# EAGLE schematic DemoBoard (EAGLE 9.6.2)
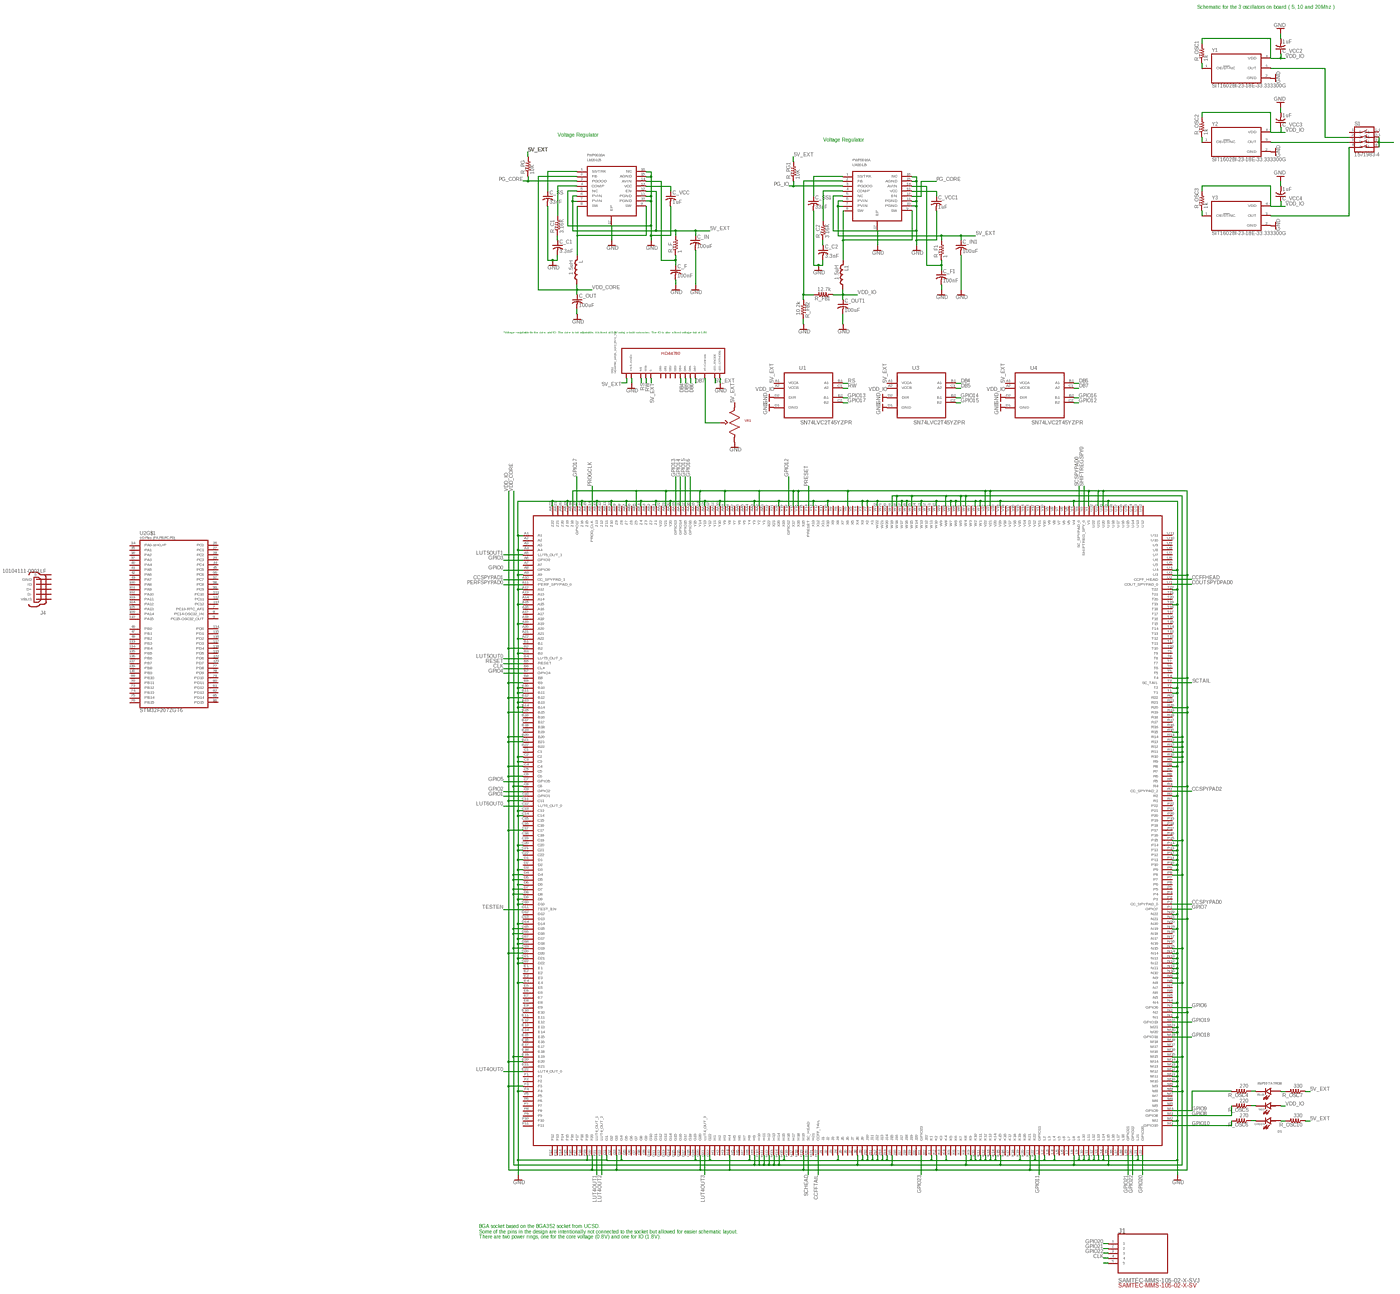
[diagram p0: schematic, sheet 1, overview]
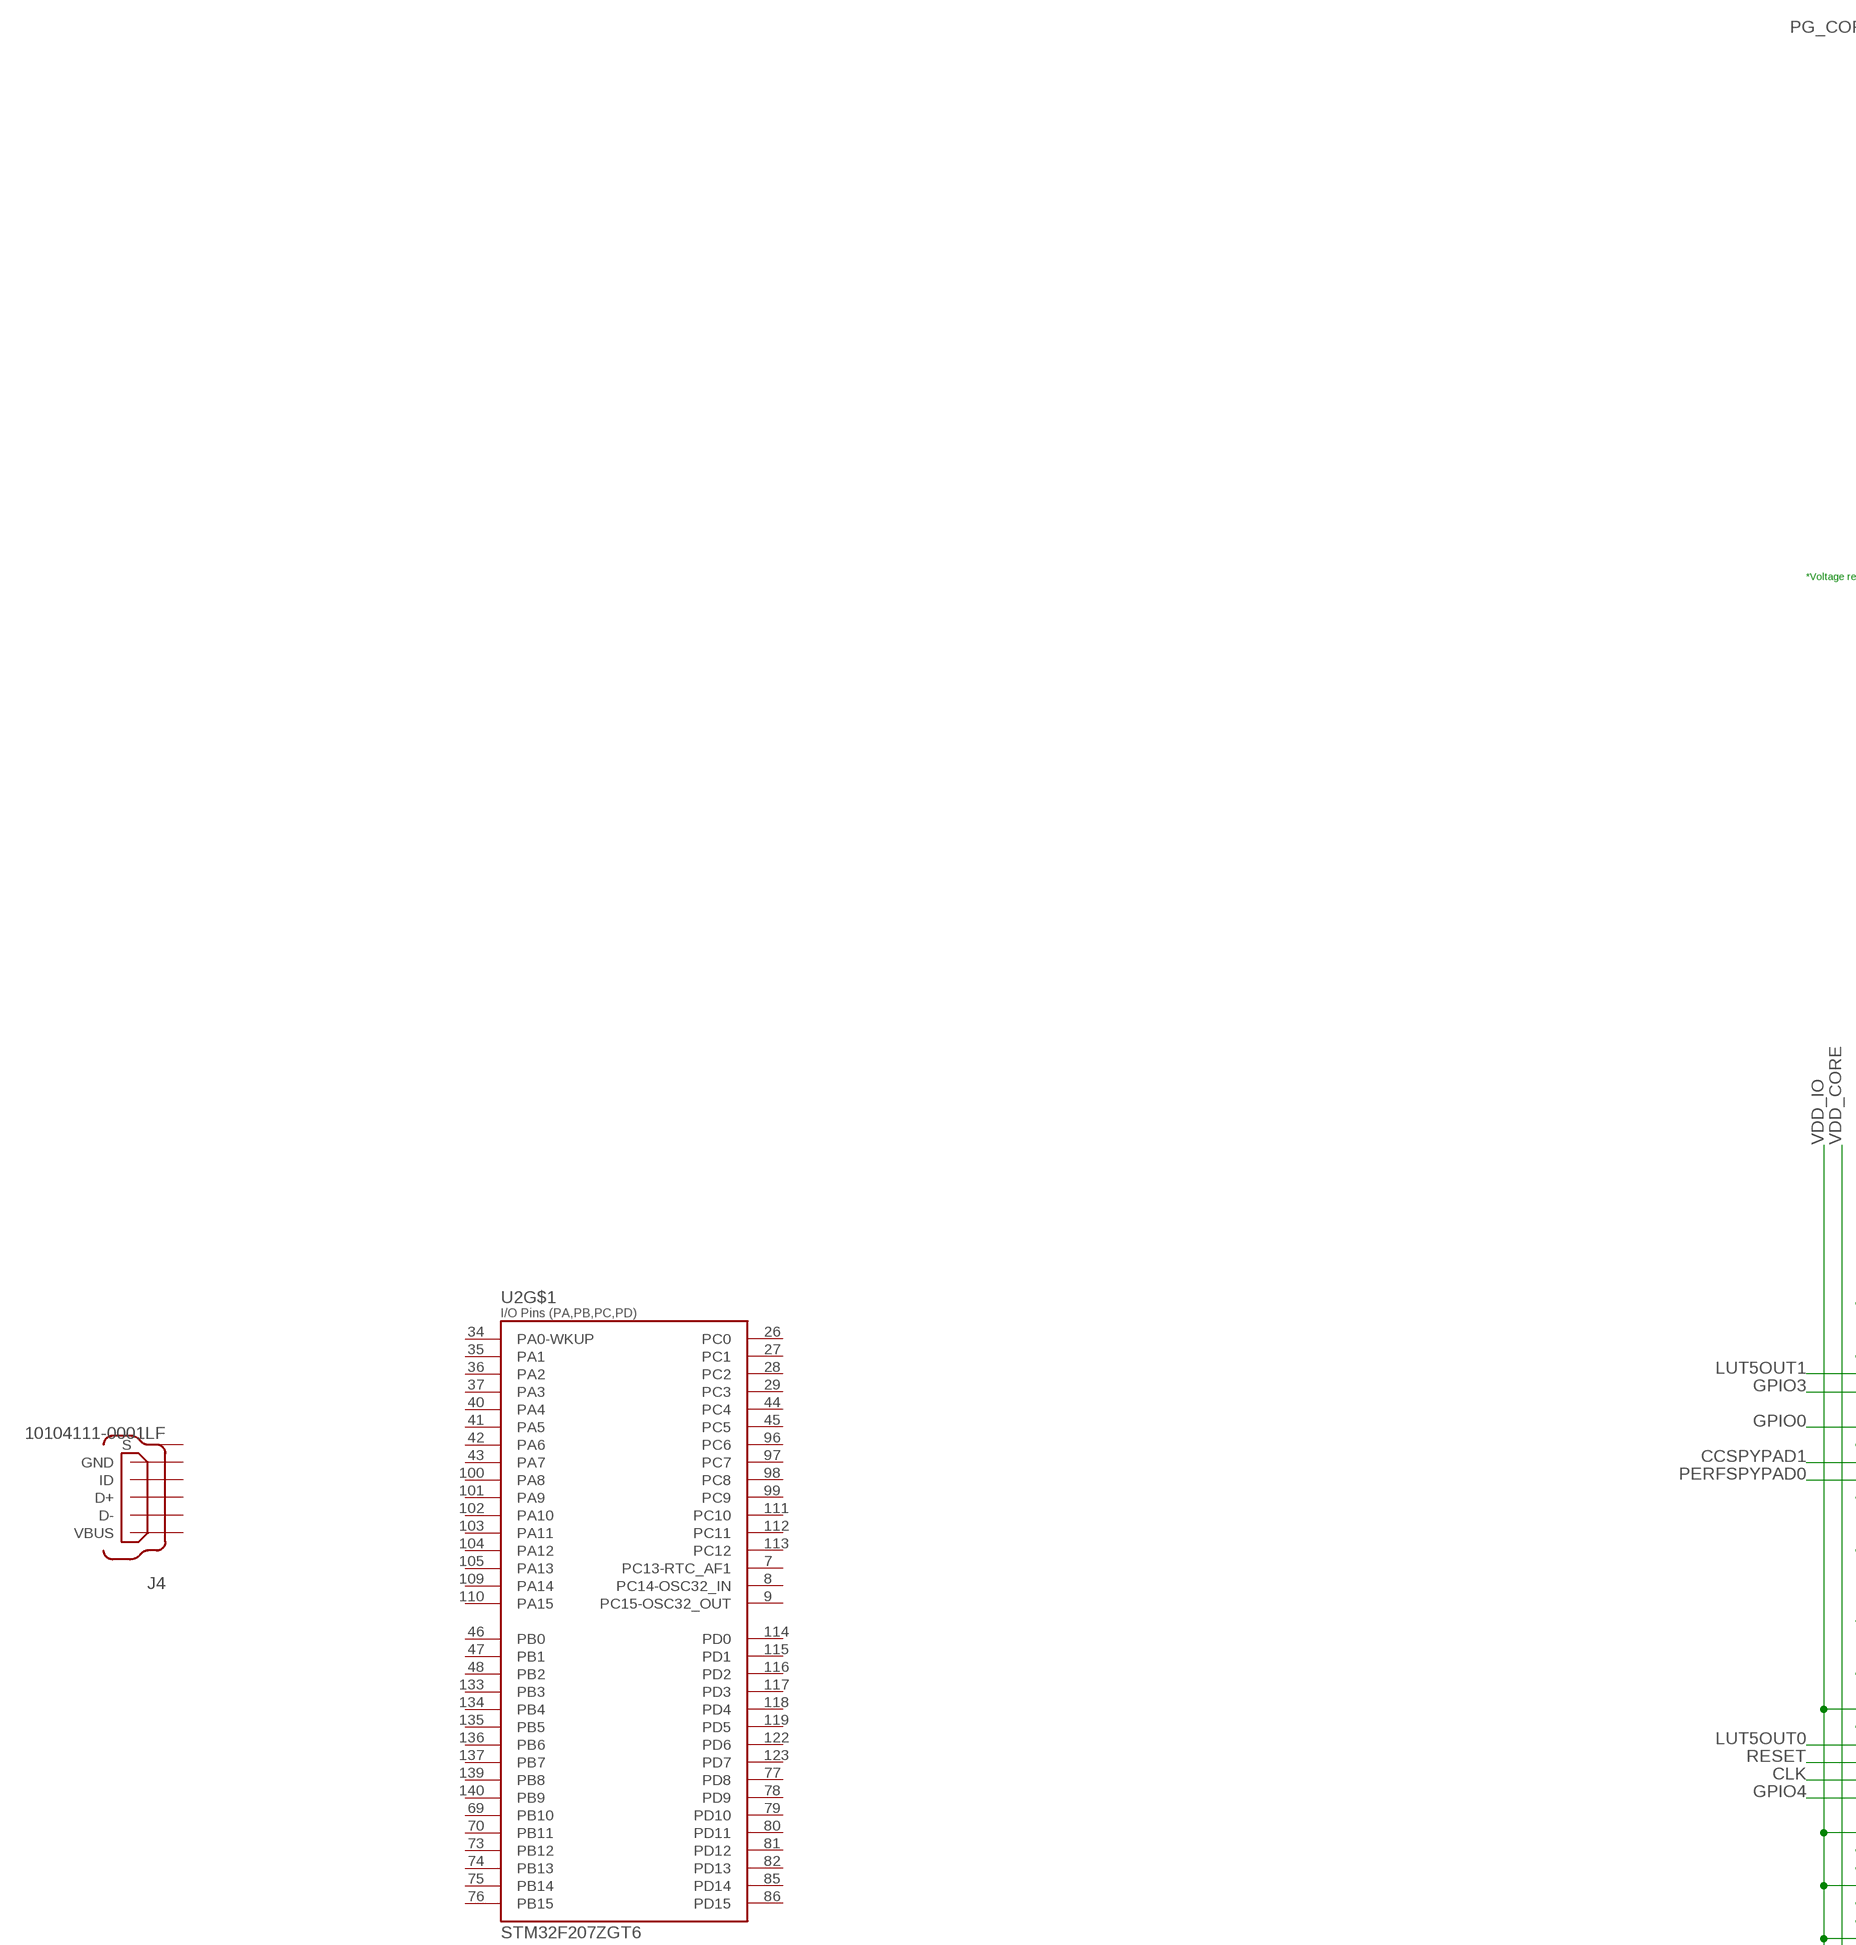
[diagram p1: schematic, sheet 1, part 1 of 4]
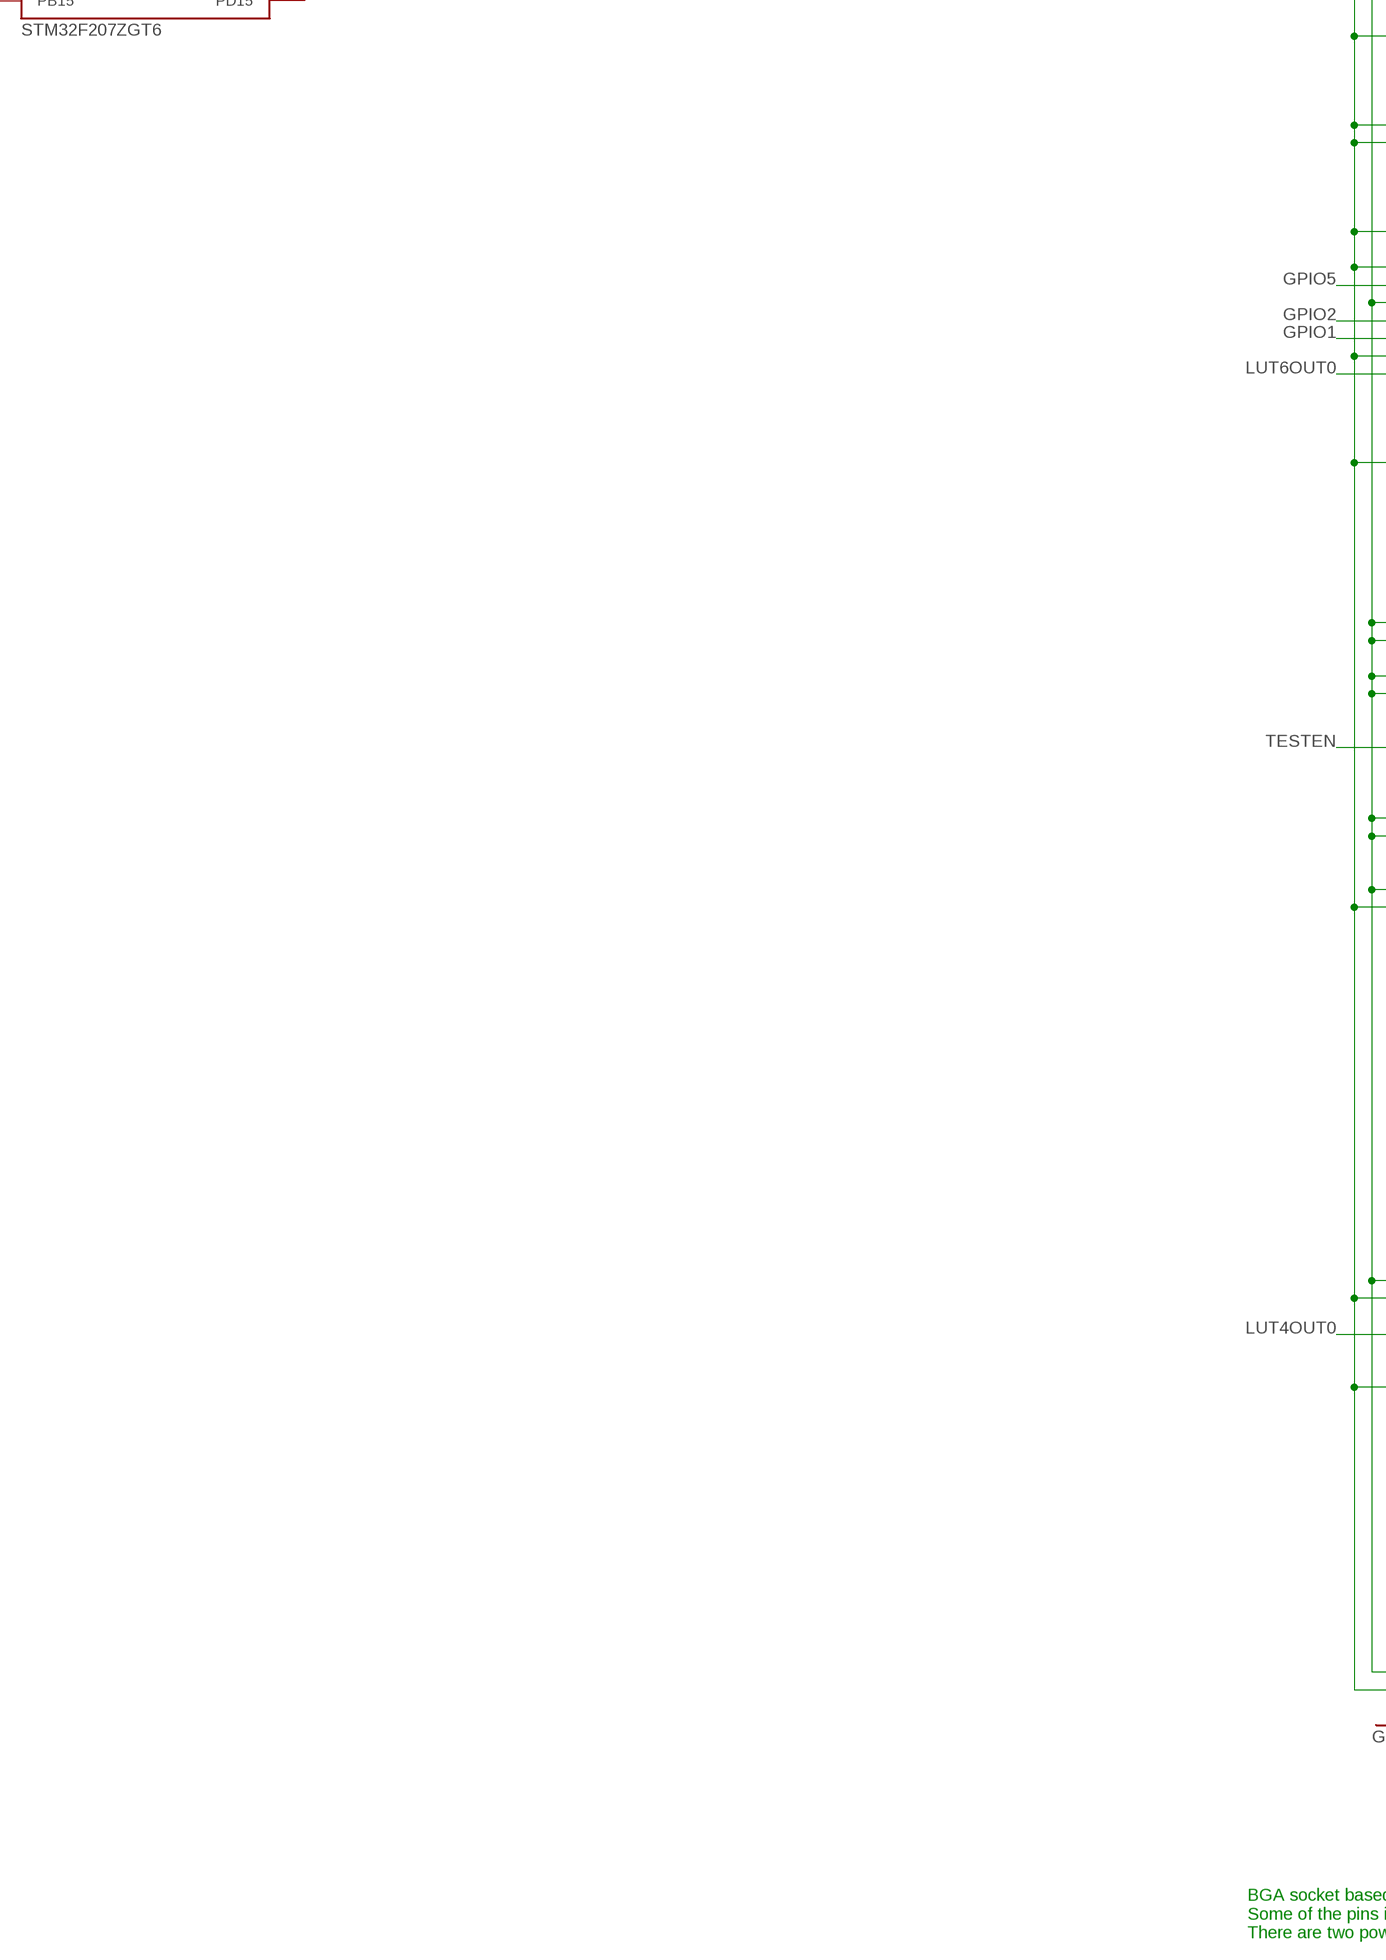
[diagram p2: schematic, sheet 1, part 2 of 4]
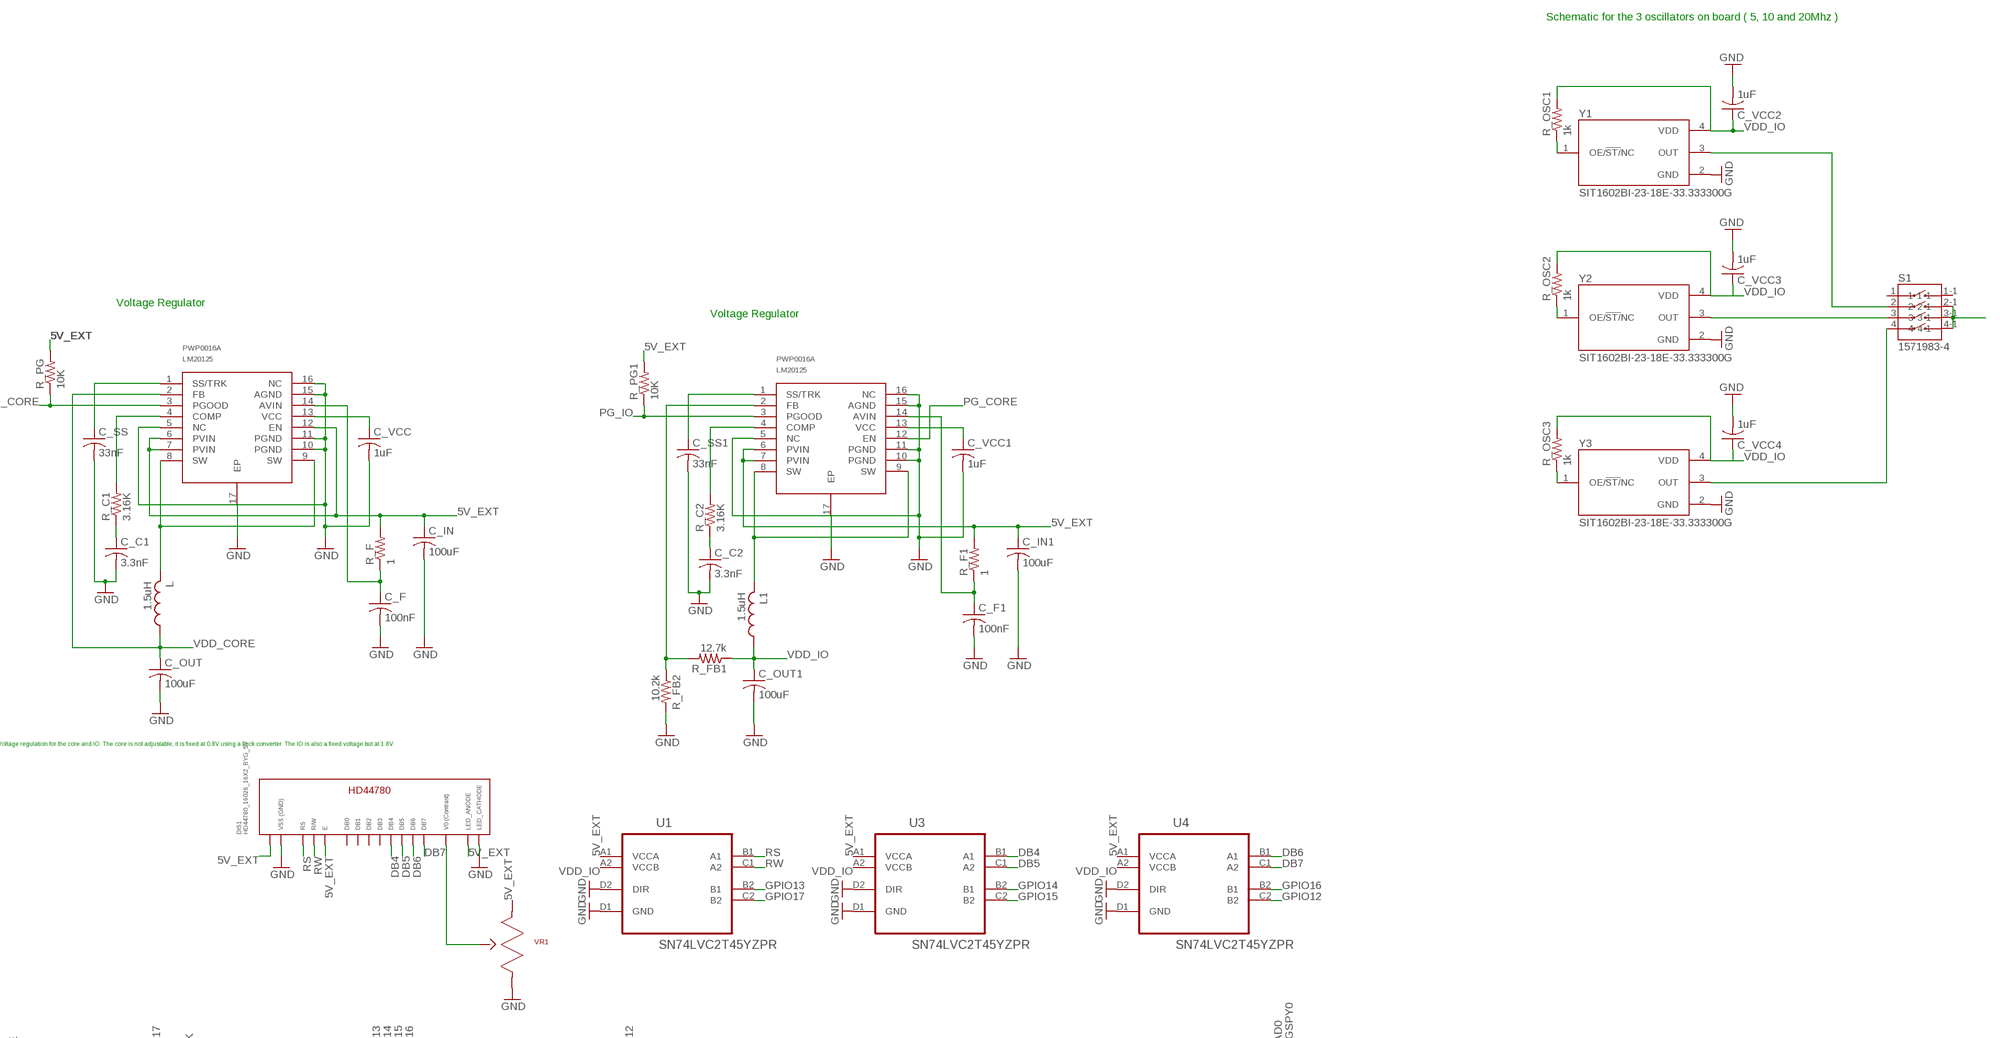
[diagram p3: schematic, sheet 1, part 3 of 4]
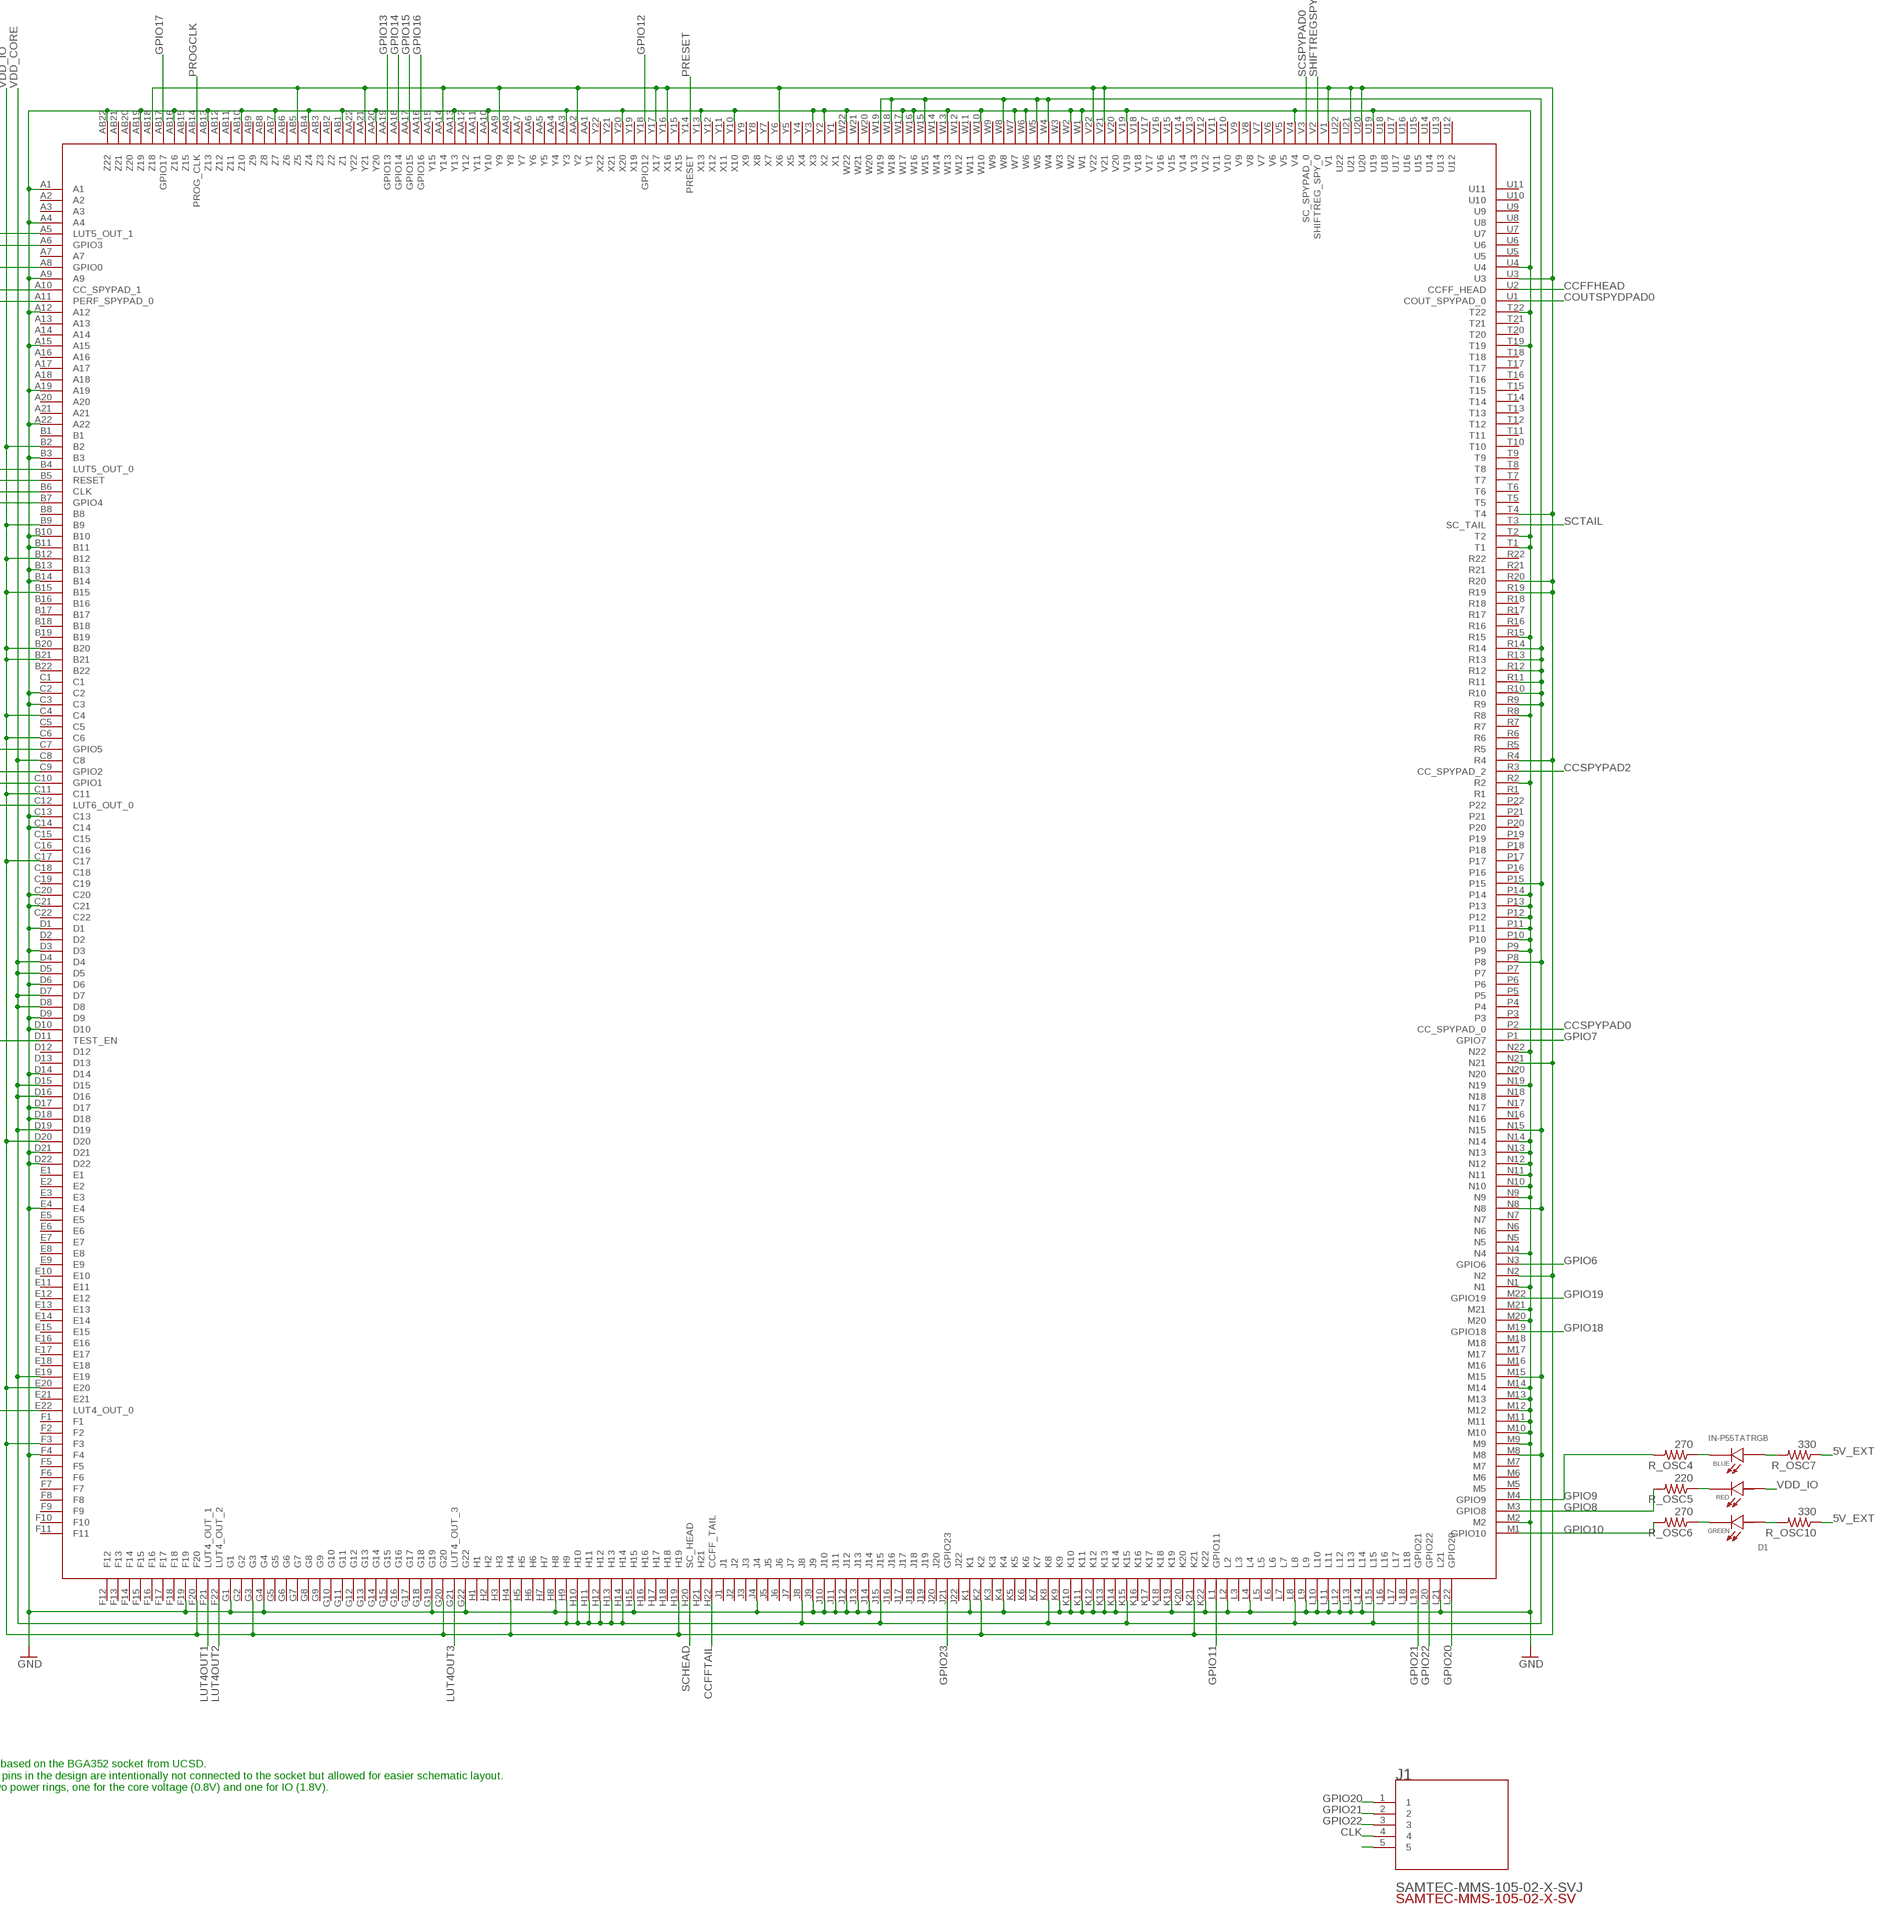
[diagram p4: schematic, sheet 1, part 4 of 4]

## Parts
C_C1  3.3nF  C-USC0805  [C0805]
C_C2  3.3nF  C-USC0805  [C0805]
C_F  100nF  C-USC0805  [C0805]
C_F1  100nF  C-USC0805  [C0805]
C_IN  100uF  C-USC0805  [C0805]
C_IN1  100uF  C-USC0805  [C0805]
C_OUT  100uF  C-USC0805  [C0805]
C_OUT1  100uF  C-USC0805  [C0805]
C_SS  33nF  C-USC0805  [C0805]
C_SS1  33nF  C-USC0805  [C0805]
C_VCC  1uF  C-USC0805  [C0805]
C_VCC1  1uF  C-USC0805  [C0805]
C_VCC2  1uF  C-USC0805  [C0805]
C_VCC3  1uF  C-USC0805  [C0805]
C_VCC4  1uF  C-USC0805  [C0805]
D1  IN-P55TATRGB  [LED_IN-P55TATRGB]
DIS1  HD44780_16026_16X2_BYG_5V  [16026-16X2]
J1  SAMTEC-MMS-105-02-X-SVJ  [SAMTEC-MMS-105-02-X-SV]
J4  10104111-0001LF  [FRAMATOME_10104111-0001LF]
L  1.5uH  L-US0204V  [0204V]
L1  1.5uH  L-US0204V  [0204V]
R_C1  3.16K  R-US_R0805  [R0805]
R_C2  3.16K  R-US_R0805  [R0805]
R_F  1  R-US_R0805  [R0805]
R_F1  1  R-US_R0805  [R0805]
R_FB1  12.7k  R-US_R0805  [R0805]
R_FB2  10.2k  R-US_R0805  [R0805]
R_OSC1  1k  R-US_R0805  [R0805]
R_OSC2  1k  R-US_R0805  [R0805]
R_OSC3  1k  R-US_R0805  [R0805]
R_OSC4  270  R-US_R0805  [R0805]
R_OSC5  220  R-US_R0805  [R0805]
R_OSC6  270  R-US_R0805  [R0805]
R_OSC7  330  R-US_R0805  [R0805]
R_OSC10  330  R-US_R0805  [R0805]
R_PG  10K  R-US_R0805  [R0805]
R_PG1  10K  R-US_R0805  [R0805]
S1  1571983-4  [SW_1571983-4]
U1  SN74LVC2T45YZPR  [BGA8C50P2X4_190X90X50]
U2  STM32F207ZGT6  [QFP50P2200X2200X160-144N]
U3  SN74LVC2T45YZPR  [BGA8C50P2X4_190X90X50]
U4  SN74LVC2T45YZPR  [BGA8C50P2X4_190X90X50]
U$1  LM20125/LM20125Q  [SOP65P640X120-17T330L]
U$2  BGA352  [BGA484C100P22X22_2400X2400X220N]
U$3  LM20125/LM20125Q  [SOP65P640X120-17T330L]
VR1  PTV09A-4225F-B104  [PTV09]
Y1  SIT1602BI-23-18E-33.333300G  [OSCDFN320X250X80-4N]
Y2  SIT1602BI-23-18E-33.333300G  [OSCDFN320X250X80-4N]
Y3  SIT1602BI-23-18E-33.333300G  [OSCDFN320X250X80-4N]

## Nets
5V_EXT: C_IN1.1 C_IN.1 R_F1.2 R_F.2 R_PG1.2 R_PG.2 U$1.6(PVIN) U$1.7(PVIN) U$1.12(EN) U$3.6(PVIN) U$3.7(PVIN)
CCFFHEAD: U$2.U2(CCFF_HEAD)
CCFFTAIL: U$2.H22(CCFF_TAIL)
CCSPYPAD0: U$2.P2(CC_SPYPAD_0)
CCSPYPAD1: U$2.A10(CC_SPYPAD_1)
CCSPYPAD2: U$2.R3(CC_SPYPAD_2)
CLK: J1.4 U$2.B6(CLK)
COUTSPYDPAD0: U$2.U1(COUT_SPYPAD_0)
DB4: DIS1.P$11(DB4) U3.B1(A1)
DB5: DIS1.P$12(DB5) U3.C1(A2)
DB6: DIS1.P$13(DB6) U4.B1(A1)
DB7: DIS1.P$14(DB7) U4.C1(A2)
E: DIS1.P$6(E)
GND: C_C1.2 C_C2.2 C_F1.2 C_F.2 C_IN1.2 C_IN.2 C_OUT1.2 C_OUT.2 C_SS1.2 C_SS.2 C_VCC1.2 C_VCC2.2 C_VCC3.2 C_VCC4.2 C_VCC.2 DIS1.P$1(VSS) DIS1.P$16(LED_C) R_FB2.2 U1.D1(GND) U1.D2(DIR) U3.D1(GND) U3.D2(DIR) U4.D1(GND) U4.D2(DIR) U$1.5(NC) U$1.10(PGND) U$1.11(PGND) U$1.15(AGND) U$1.16(NC) U$1.17(EP) U$2.A1 U$2.A4 U$2.A9 U$2.A12 U$2.A15 U$2.A19 U$2.A22 U$2.AA3(Y3) U$2.AA10(Y10) U$2.AA13(Y13) U$2.AA20(Y20) U$2.AB1(Z1) U$2.AB4(Z4) U$2.AB7(Z7) U$2.AB10(Z10) U$2.AB13(Z13) U$2.AB16(Z16) U$2.AB19(Z19) U$2.AB22(Z22) U$2.B3 U$2.B10 U$2.B11 U$2.B13 U$2.B14 U$2.C2 U$2.C3 U$2.C13 U$2.C14 U$2.C20 U$2.C21 U$2.D1 U$2.D3 U$2.D6 U$2.D9 U$2.D10 U$2.D14 U$2.D17 U$2.D18 U$2.D21 U$2.D22 U$2.E4 U$2.F4 U$2.F19 U$2.G1 U$2.G4 U$2.G19 U$2.G22 U$2.H8 U$2.H15 U$2.J4 U$2.J9 U$2.J10 U$2.J11 U$2.J12 U$2.J13 U$2.J14 U$2.K1 U$2.K4 U$2.K9 U$2.K10 U$2.K11 U$2.K12 U$2.K13 U$2.K14 U$2.K19 U$2.K22 U$2.L2 U$2.L4 U$2.L9 U$2.L10 U$2.L11 U$2.L12 U$2.L13 U$2.L14 U$2.L21 U$2.M2 U$2.M9 U$2.M10 U$2.M11 U$2.M12 U$2.M13 U$2.M14 U$2.M20 U$2.M21 U$2.N1 U$2.N4 U$2.N9 U$2.N10 U$2.N11 U$2.N12 U$2.N13 U$2.N14 U$2.N19 U$2.N22 U$2.P9 U$2.P10 U$2.P11 U$2.P12 U$2.P13 U$2.P14 U$2.R2 U$2.R8 U$2.R15 U$2.T1 U$2.T2 U$2.T19 U$2.T22 U$2.U4 U$2.U19 U$2.V4 U$2.V19 U$2.W1 U$2.W2 U$2.W6 U$2.W7 U$2.W10 U$2.W13 U$2.W16 U$2.W17 U$2.W22 U$2.Y2(X2) U$2.Y3(X3) U$2.Y10(X10) U$2.Y13(X13) U$2.Y20(X20) U$3.5(NC) U$3.10(PGND) U$3.11(PGND) U$3.15(AGND) U$3.16(NC) U$3.17(EP) VR1.3 Y1.2(GND) Y2.2(GND) Y3.2(GND)
GPIO0: U$2.A8(GPIO0)
GPIO1: U$2.C10(GPIO1)
GPIO2: U$2.C9(GPIO2)
GPIO3: U$2.A6(GPIO3)
GPIO4: U$2.B7(GPIO4)
GPIO5: U$2.C7(GPIO5)
GPIO6: U$2.N3(GPIO6)
GPIO7: U$2.P1(GPIO7)
GPIO8: R_OSC5.2 U$2.M3(GPIO8)
GPIO9: R_OSC4.2 U$2.M4(GPIO9)
GPIO10: R_OSC6.2 U$2.M1(GPIO10)
GPIO11: U$2.L1(GPIO11)
GPIO12: U4.C2(B2) U$2.Y18(GPIO12)
GPIO13: U1.B2(B1) U$2.AA19(GPIO13)
GPIO14: U3.B2(B1) U$2.AA18(GPIO14)
GPIO15: U3.C2(B2) U$2.AA17(GPIO15)
GPIO16: U4.B2(B1) U$2.AA16(GPIO16)
GPIO17: U1.C2(B2) U$2.AB17(GPIO17)
GPIO18: U$2.M19(GPIO18)
GPIO19: U$2.M22(GPIO19)
GPIO20: J1.1 U$2.L22(GPIO20)
GPIO21: J1.2 U$2.L19(GPIO21)
GPIO22: J1.3 U$2.L20(GPIO22)
GPIO23: U$2.J21(GPIO23)
LUT4OUT0: U$2.E22(LUT4_OUT_0)
LUT4OUT1: U$2.F21(LUT4_OUT_1)
LUT4OUT2: U$2.F22(LUT4_OUT_2)
LUT4OUT3: U$2.G21(LUT4_OUT_3)
LUT5OUT0: U$2.B4(LUT5_OUT_0)
LUT5OUT1: U$2.A5(LUT5_OUT_1)
LUT6OUT0: U$2.C12(LUT6_OUT_0)
N$1: R_C2.2 U$3.4(COMP)
N$2: C_SS.1 U$1.1(SS/TRK)
N$3: R_C1.2 U$1.4(COMP)
N$4: C_C1.1 R_C1.1
N$5: C_VCC.1 U$1.13(VCC)
N$6: C_C2.1 R_C2.1
N$7: L.2 U$1.8(SW) U$1.9(SW)
N$8: C_VCC1.1 U$3.13(VCC)
N$9: C_SS1.1 U$3.1(SS/TRK)
N$10: L1.2 U$3.8(SW) U$3.9(SW)
N$11: C_F1.1 R_F1.1 U$3.14(AVIN)
N$12: C_F.1 R_F.1 U$1.14(AVIN)
N$13: S1.2 Y1.3(OUT)
N$15: R_OSC1.1 Y1.1(OE/!ST/!NC)
N$16: S1.3 Y2.3(OUT)
N$18: R_OSC2.1 Y2.1(OE/!ST/!NC)
N$19: S1.4 Y3.3(OUT)
N$21: R_OSC3.1 Y3.1(OE/!ST/!NC)
N$22: S1.2-1 S1.3-1 S1.4-1
N$23: C_VCC3.1
N$24: C_VCC4.1
N$25: R_OSC7.1
N$28: R_OSC10.1
N$29: DIS1.P$2(VDD)
N$30: D1.1(B_C) R_OSC4.1
N$31: D1.2(R_C) R_OSC5.1
N$32: D1.3(G_C) R_OSC6.1
N$33: DIS1.P$3(CONTRAST) VR1.2
N$36: J1.5
PERFSPYPAD0: U$2.A11(PERF_SPYPAD_0)
PG_CORE: R_PG.1 U$1.3(PGOOD) U$3.12(EN)
PG_IO: R_PG1.1 U$3.3(PGOOD)
PRESET: U$2.Y14(PRESET)
PROGCLK: U$2.AB14(PROG_CLK)
RESET: U$2.B5(RESET)
RS: DIS1.P$4(RS) U1.B1(A1)
RW: DIS1.P$5(R/W) U1.C1(A2)
SCHEAD: U$2.H20(SC_HEAD)
SCSPYPAD0: U$2.V3(SC_SPYPAD_0)
SCTAIL: U$2.T3(SC_TAIL)
SHIFTREGSPY0: U$2.V2(SHIFTREG_SPY_0)
TESTEN: U$2.D11(TEST_EN)
V5: DIS1.P$15(LED_A)
VCC33: D1.4(G_A) D1.6(B_A) R_OSC7.2 R_OSC10.2
VDD_CORE: C_OUT.1 L.1 R_FB1.2 R_FB2.1 U$1.2(FB) U$2.C8 U$2.D4 U$2.D5 U$2.D7 U$2.D8 U$2.D15 U$2.D16 U$2.D19 U$2.E19 U$2.H9 U$2.H10 U$2.H11 U$2.H12 U$2.H13 U$2.H14 U$2.J8 U$2.J15 U$2.K8 U$2.K15 U$2.L8 U$2.L15 U$2.M8 U$2.M15 U$2.N8 U$2.N15 U$2.P8 U$2.P15 U$2.R9 U$2.R10 U$2.R11 U$2.R12 U$2.R13 U$2.R14 U$2.W4 U$2.W5 U$2.W8 U$2.W15 U$2.W18 U$2.W19 U$3.2(FB)
VDD_IO: C_OUT1.1 C_VCC2.1 D1.5(R_A) L1.1 R_FB1.1 R_OSC1.2 R_OSC2.2 R_OSC3.2 U$2.AA2(Y2) U$2.AA9(Y9) U$2.AA14(Y14) U$2.AA21(Y21) U$2.AB5(Z5) U$2.AB18(Z18) U$2.B2 U$2.B9 U$2.B12 U$2.B15 U$2.B20 U$2.B21 U$2.C4 U$2.C6 U$2.C11 U$2.C17 U$2.D20 U$2.E20 U$2.F3 U$2.F20 U$2.G3 U$2.G20 U$2.H4 U$2.H19 U$2.K2 U$2.K21 U$2.N2 U$2.N21 U$2.R4 U$2.R19 U$2.R20 U$2.T4 U$2.U3 U$2.U20 U$2.U21 U$2.V1 U$2.V21 U$2.V22 U$2.Y6(X6) U$2.Y16(X16) U$2.Y17(X17) Y1.4(VDD) Y2.4(VDD) Y3.4(VDD)
Unconnected: DIS1.P$7(DB0) DIS1.P$8(DB1) DIS1.P$9(DB2) DIS1.P$10(DB3) J4.2(D-) J4.3(D+) J4.4(ID) S1.1 S1.1-1 U2.1(PE2) U2.2(PE3) U2.3(PE4) U2.4(PE5) U2.5(PE6) U2.7(PC13-RTC_AF1) U2.8(PC14-OSC32_IN) U2.9(PC15-OSC32_OUT) U2.10(PF0) U2.11(PF1) U2.12(PF2) U2.13(PF3) U2.14(PF4) U2.15(PF5) U2.18(PF6) U2.19(PF7) U2.20(PF8) U2.21(PF9) U2.22(PF10) U2.23(PH0-OSC_IN) U2.24(PH1-OSC_OUT) U2.25(NRST) U2.26(PC0) U2.27(PC1) U2.28(PC2) U2.29(PC3) U2.34(PA0-WKUP) U2.35(PA1) U2.36(PA2) U2.37(PA3) U2.40(PA4) U2.41(PA5) U2.42(PA6) U2.43(PA7) U2.44(PC4) U2.45(PC5) U2.46(PB0) U2.47(PB1) U2.48(PB2) U2.49(PF11) U2.50(PF12) U2.53(PF13) U2.54(PF14) U2.55(PF15) U2.56(PG0) U2.57(PG1) U2.58(PE7) U2.59(PE8) U2.60(PE9) U2.63(PE10) U2.64(PE11) U2.65(PE12) U2.66(PE13) U2.67(PE14) U2.68(PE15) U2.69(PB10) U2.70(PB11) U2.73(PB12) U2.74(PB13) U2.75(PB14) U2.76(PB15) U2.77(PD8) U2.78(PD9) U2.79(PD10) U2.80(PD11) U2.81(PD12) U2.82(PD13) U2.85(PD14) U2.86(PD15) U2.87(PG2) U2.88(PG3) U2.89(PG4) U2.90(PG5) U2.91(PG6) U2.92(PG7) U2.93(PG8) U2.96(PC6) U2.97(PC7) U2.98(PC8) U2.99(PC9) U2.100(PA8) U2.101(PA9) U2.102(PA10) U2.103(PA11) U2.104(PA12) U2.105(PA13) U2.109(PA14) U2.110(PA15) U2.111(PC10) U2.112(PC11) U2.113(PC12) U2.114(PD0) U2.115(PD1) U2.116(PD2) U2.117(PD3) U2.118(PD4) U2.119(PD5) U2.122(PD6) U2.123(PD7) U2.124(PG9) U2.125(PG10) U2.126(PG11) U2.127(PG12) U2.128(PG13) U2.129(PG14) U2.132(PG15) U2.133(PB3) U2.134(PB4) U2.135(PB5) U2.136(PB6) U2.137(PB7) U2.138(BOOT0) U2.139(PB8) U2.140(PB9) U2.141(PE0) U2.142(PE1) U2.143(RFU) U$2.A2 U$2.A3 U$2.A7 U$2.A13 U$2.A14 U$2.A16 U$2.A17 U$2.A18 U$2.A20 U$2.A21 U$2.AA1(Y1) U$2.AA4(Y4) U$2.AA5(Y5) U$2.AA6(Y6) U$2.AA7(Y7) U$2.AA8(Y8) U$2.AA11(Y11) U$2.AA12(Y12) U$2.AA15(Y15) U$2.AA22(Y22) U$2.AB2(Z2) U$2.AB3(Z3) U$2.AB6(Z6) U$2.AB8(Z8) U$2.AB9(Z9) U$2.AB11(Z11) U$2.AB12(Z12) U$2.AB15(Z15) U$2.AB20(Z20) U$2.AB21(Z21) U$2.B1 U$2.B8 U$2.B16 U$2.B17 U$2.B18 U$2.B19 U$2.B22 U$2.C1 U$2.C5 U$2.C15 U$2.C16 U$2.C18 U$2.C19 U$2.C22 U$2.D2 U$2.D12 U$2.D13 U$2.E1 U$2.E2 U$2.E3 U$2.E5 U$2.E6 U$2.E7 U$2.E8 U$2.E9 U$2.E10 U$2.E11 U$2.E12 U$2.E13 U$2.E14 U$2.E15 U$2.E16 U$2.E17 U$2.E18 U$2.E21 U$2.F1 U$2.F2 U$2.F5 U$2.F6 U$2.F7 U$2.F8 U$2.F9 U$2.F10 U$2.F11 U$2.F12 U$2.F13 U$2.F14 U$2.F15 U$2.F16 U$2.F17 U$2.F18 U$2.G2 U$2.G5 U$2.G6 U$2.G7 U$2.G8 U$2.G9 U$2.G10 U$2.G11 U$2.G12 U$2.G13 U$2.G14 U$2.G15 U$2.G16 U$2.G17 U$2.G18 U$2.H1 U$2.H2 U$2.H3 U$2.H5 U$2.H6 U$2.H7 U$2.H16 U$2.H17 U$2.H18 U$2.H21 U$2.J1 U$2.J2 U$2.J3 U$2.J5 U$2.J6 U$2.J7 U$2.J16 U$2.J17 U$2.J18 U$2.J19 U$2.J20 U$2.J22 U$2.K3 U$2.K5 U$2.K6 U$2.K7 U$2.K16 U$2.K17 U$2.K18 U$2.K20 U$2.L3 U$2.L5 U$2.L6 U$2.L7 U$2.L16 U$2.L17 U$2.L18 U$2.M5 U$2.M6 U$2.M7 U$2.M16 U$2.M17 U$2.M18 U$2.N5 U$2.N6 U$2.N7 U$2.N16 U$2.N17 U$2.N18 U$2.N20 U$2.P3 U$2.P4 U$2.P5 U$2.P6 U$2.P7 U$2.P16 U$2.P17 U$2.P18 U$2.P19 U$2.P20 U$2.P21 U$2.P22 U$2.R1 U$2.R5 U$2.R6 U$2.R7 U$2.R16 U$2.R17 U$2.R18 U$2.R21 U$2.R22 U$2.T5 U$2.T6 U$2.T7 U$2.T8 U$2.T9 U$2.T10 U$2.T11 U$2.T12 U$2.T13 U$2.T14 U$2.T15 U$2.T16 U$2.T17 U$2.T18 U$2.T20 U$2.T21 U$2.U5 U$2.U6 U$2.U7 U$2.U8 U$2.U9 U$2.U10 U$2.U11 U$2.U12 U$2.U13 U$2.U14 U$2.U15 U$2.U16 U$2.U17 U$2.U18 U$2.U22 U$2.V5 U$2.V6 U$2.V7 U$2.V8 U$2.V9 U$2.V10 U$2.V11 U$2.V12 U$2.V13 U$2.V14 U$2.V15 U$2.V16 U$2.V17 U$2.V18 U$2.V20 U$2.W3 U$2.W9 U$2.W11 U$2.W12 U$2.W14 U$2.W20 U$2.W21 U$2.Y1(X1) U$2.Y4(X4) U$2.Y5(X5) U$2.Y7(X7) U$2.Y8(X8) U$2.Y9(X9) U$2.Y11(X11) U$2.Y12(X12) U$2.Y15(X15) U$2.Y19(X19) U$2.Y21(X21) U$2.Y22(X22) VR1.1

## Notes on the sheet
- Schematic for the 3 oscillators on board ( 5, 10 and 20Mhz )
- Voltage Regulator
- Voltage Regulator
- *Voltage regulation for the core and IO. The core is not adjustable, it is fixed at 0.8V using a buck converter. The IO is also a fixed voltage but at 1.8V.
- BGA socket based on the BGA352 socket from UCSD. 
  Some of the pins in the design are intentionally not connected to the socket but allowed for easier schematic layout.
  There are two power rings, one for the core voltage (0.8V) and one for IO (1.8V).

## Power pins joined to a net without a drawn wire
GND: J4.5(GND)
S: J4.6(S) J4.7(S) J4.8(S) J4.9(S)
VBAT: U2.6(VBAT)
VBUS: J4.1(VBUS)
VCAP_1: U2.71(VCAP_1)
VCAP_2: U2.106(VCAP_2)
VCCA: U1.A1(VCCA) U3.A1(VCCA) U4.A1(VCCA)
VCCB: U1.A2(VCCB) U3.A2(VCCB) U4.A2(VCCB)
VDD: U2.17(VDD) U2.30(VDD) U2.39(VDD) U2.52(VDD) U2.62(VDD) U2.72(VDD) U2.84(VDD) U2.95(VDD) U2.108(VDD) U2.121(VDD) U2.131(VDD) U2.144(VDD)
VDDA: U2.33(VDDA)
VREF+: U2.32(VREF+)
VSS: U2.16(VSS) U2.38(VSS) U2.51(VSS) U2.61(VSS) U2.83(VSS) U2.94(VSS) U2.107(VSS) U2.120(VSS) U2.130(VSS)
VSSA: U2.31(VSSA)

## Library data of the parts
C_C1 C_C2 C_F C_F1 C_IN C_IN1 C_OUT C_OUT1 C_SS C_SS1 C_VCC C_VCC1-C_VCC4 = adafruit:C-US: CAPACITOR, American symbol
D1 = IN-P55TATRGB:IN-P55TATRGB: Red, Green, Blue (RGB) 624nm Red, 520nm Green, 468nm Blue LED Indication - Discrete 2V Red, 3.2V Green, 3.2V Blue 6-SMD, J-Lead Buy Part <https://snapeda.com/parts/IN-P55TATRGB/Inolux/view-part/?ref=eda>; AVAILABILITY: Warning; DESCRIPTION: Red, Green, Blue (RGB) 624nm Red, 520nm Green, 468nm Blue LED Indication - Discrete 2V Red, 3.2V Green, 3.2V Blue 6-SMD, J-Lead; MF: Inolux; MOUSER-PURCHASE-URL: https://snapeda.com/shop?store=Mouser&id=3600412; MP: IN-P55TATRGB; PACKAGE: SMD-6 Inolux; PRICE: None
DIS1 = HD44780:HD44780: Library: MF_Displays Description: Device for HD44780 Complaint Displays. Manufacture part number (MFG#) can be added via Attributes.; AVAILABILITY: Unavailable; DESCRIPTION: Character LCD Display Module Transflective 5 x 8 Dots STN - Super-Twisted Nematic LED - White Parallel 98.00mm x 60.00mm x 11.60mm; MF: Lumex Opto/Components; MP: HD44780; PACKAGE: None; PRICE: None
J1 = connector5pin:SAMTEC-MMS-105-02-X-SV: Buy Part <https://snapeda.com/parts/MMS-105-02-L-SV-K/Samtec/view-part/?ref=eda>; AVAILABILITY: Bad; DESCRIPTION: 5 Position Receptacle Connector Surface Mount; MF: Samtec; MP: MMS-105-02-L-SV-K; PACKAGE: None; PRICE: None
J4 = microUSBAB:10104111-0001LF: Conn USB Type A/B RCP 5 POS 0.65mm Solder RA SMD 5 Terminal 1 Port T/R Buy Part <https://snapeda.com/parts/10104111-0001LF/Amphenol%20ICC/view-part/?ref=eda>; ARROW_ELECTRONICS-PURCHASE-URL: https://snapeda.com/shop?store=Arrow+Electronics&id=2753161; AVAILABILITY: Good; DESCRIPTION: USB - micro AB USB 2.0 Receptacle Connector 5 Position Surface Mount, Right Angle; DIGIKEY-PURCHASE-URL: https://snapeda.com/shop?store=DigiKey&id=2753161; MF: Amphenol ICC; MOUSER-PURCHASE-URL: https://snapeda.com/shop?store=Mouser&id=2753161; MP: 10104111-0001LF; PACKAGE: None; PRICE: None
L L1 = rcl:L-US: INDUCTOR, American symbol; SPICEPREFIX: L
R_C1 R_C2 R_F R_F1 R_FB1 R_FB2 R_OSC1-R_OSC7 R_OSC10 R_PG R_PG1 = rcl:R-US_: RESISTOR, American symbol; SPICEPREFIX: R
S1 = 1571983-4:1571983-4: SWITCH SLIDE DIP SPST 25MA 24V Buy Part <https://snapeda.com/parts/1571983-4/TE%20Connectivity/view-part/?ref=eda>; ARROW_ELECTRONICS-PURCHASE-URL: https://snapeda.com/shop?store=Arrow+Electronics&id=2889756; AVAILABILITY: Good; COMMENT: 1571983-4; DESCRIPTION: Dip Switch SPST 4 Position Surface Mount Slide (Standard) Actuator 25mA 24VDC; DIGIKEY-PURCHASE-URL: https://snapeda.com/shop?store=DigiKey&id=2889756; MF: TE Connectivity; MP: 1571983-4; PACKAGE: None; PRICE: None
U1 U3 U4 = SN74LVC2T45YZPR:SN74LVC2T45YZPR: DUAL-BIT DUAL-SUPPLY BUS TRANSCEIVER Buy Part <https://snapeda.com/parts/SN74LVC2T45YZPR/Texas%20Instruments/view-part/?ref=eda>; AVAILABILITY: Warning; DESCRIPTION: 2-Bit Dual Supply Transceiver with Configurable Voltage-Level Shifting and 3-State Outputs 8-DSBGA -40 to 85; MF: Texas Instruments; MOUSER-PURCHASE-URL: https://snapeda.com/shop?store=Mouser&id=317071; MP: SN74LVC2T45YZPR; PACKAGE: DSBGA-8 Texas Instruments; PRICE: None; TEXAS_INSTRUMENTS-PURCHASE-URL: https://snapeda.com/shop?store=Texas+Instruments&id=317071
U2 = STM32F207ZGT6:STM32F207ZGT6: High-performance ARM Cortex-M3 MCU with 1 Mbyte Flash, 120 MHz CPU, ART Accelerator, Ethernet Buy Part <https://snapeda.com/parts/STM32F207ZGT6/STMicroelectronics/view-part/?ref=eda>; AVAILABILITY: Good; DESCRIPTION: ARM® Cortex®-M3 STM32F2 Microcontroller IC 32-Bit 120MHz 1MB (1M x 8) FLASH 144-LQFP (20x20); DIGIKEY-PURCHASE-URL: https://snapeda.com/shop?store=DigiKey&id=459075; MF: STMicroelectronics; MOUSER-PURCHASE-URL: https://snapeda.com/shop?store=Mouser&id=459075; MP: STM32F207ZGT6; PACKAGE: LQFP-144 STMicroelectronics; PRICE: None
U$1 U$3 = LM20125:LM20125/LM20125Q
U$2 = BGA352:BGA352
VR1 = PTV09A-4225F-B104:PTV09A-4225F-B104: 100k Ohm 1 Gang Linear Through Hole, Snap In Potentiometer Detent 1 Turn Carbon 0.05W, 1/20W PC Pins, Board Locks (NOT RA) Buy Part <https://snapeda.com/parts/PTV09A-4225F-B104/Bourns/view-part/?ref=eda>; ARROW_ELECTRONICS-PURCHASE-URL: https://snapeda.com/shop?store=Arrow+Electronics&id=1448300; AVAILABILITY: Warning; DESCRIPTION: 100k Ohm 1 Gang Linear Through Hole, Snap In Potentiometer Detent 1 Kierros Carbon 0.05W, 1/20W PC Pins, Board Locks; DIGIKEY-PURCHASE-URL: https://snapeda.com/shop?store=DigiKey&id=1448300; MF: Bourns; MOUSER-PURCHASE-URL: https://snapeda.com/shop?store=Mouser&id=1448300; MP: PTV09A-4225F-B104; PACKAGE: None; PRICE: None
Y1-Y3 = SIT1602BI-23-18E-33.333300G:SIT1602BI-23-18E-33.333300G: Silicon Oscillator 33.3333MHz 1.8V 15pF 4-Pin QFN T/R; AVAILABILITY: Unavailable; DESCRIPTION: 33.3333MHz XO (Standard) HCMOS, LVCMOS Oscillator 1.8V Enable/Disable 4-SMD, No Lead; MF: SiTIME; MP: SIT1602BI-23-18E-33.333300G; PACKAGE: SMD-4 SiTime; PRICE: None